# EAGLE design placa (EAGLE 5.01)
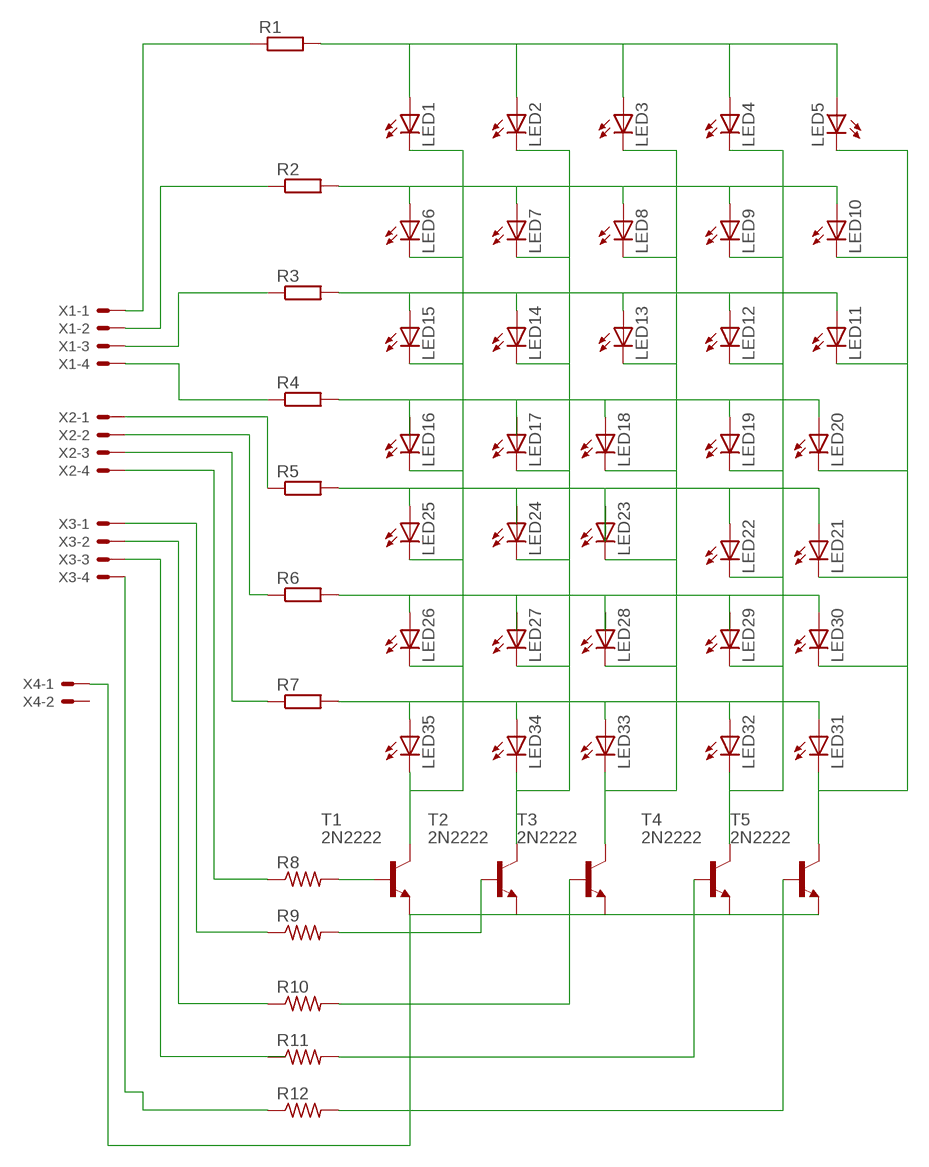
[diagram p0: schematic, sheet 1]

## Parts
LED1  LED5MM  [LED5MM]
LED2  LED5MM  [LED5MM]
LED3  LED5MM  [LED5MM]
LED4  LED5MM  [LED5MM]
LED5  LED5MM  [LED5MM]
LED6  LED5MM  [LED5MM]
LED7  LED5MM  [LED5MM]
LED8  LED5MM  [LED5MM]
LED9  LED5MM  [LED5MM]
LED10  LED5MM  [LED5MM]
LED11  LED5MM  [LED5MM]
LED12  LED5MM  [LED5MM]
LED13  LED5MM  [LED5MM]
LED14  LED5MM  [LED5MM]
LED15  LED5MM  [LED5MM]
LED16  LED5MM  [LED5MM]
LED17  LED5MM  [LED5MM]
LED18  LED5MM  [LED5MM]
LED19  LED5MM  [LED5MM]
LED20  LED5MM  [LED5MM]
LED21  LED5MM  [LED5MM]
LED22  LED5MM  [LED5MM]
LED23  LED5MM  [LED5MM]
LED24  LED5MM  [LED5MM]
LED25  LED5MM  [LED5MM]
LED26  LED5MM  [LED5MM]
LED27  LED5MM  [LED5MM]
LED28  LED5MM  [LED5MM]
LED29  LED5MM  [LED5MM]
LED30  LED5MM  [LED5MM]
LED31  LED5MM  [LED5MM]
LED32  LED5MM  [LED5MM]
LED33  LED5MM  [LED5MM]
LED34  LED5MM  [LED5MM]
LED35  LED5MM  [LED5MM]
R1  R-EU_0204/7  [0204/7]
R2  R-EU_0204/7  [0204/7]
R3  R-EU_0204/7  [0204/7]
R4  R-EU_0204/7  [0204/7]
R5  R-EU_0204/7  [0204/7]
R6  R-EU_0204/7  [0204/7]
R7  R-EU_0204/7  [0204/7]
R8  R-US_0204/7  [0204/7]
R9  R-US_0204/7  [0204/7]
R10  R-US_0204/7  [0204/7]
R11  R-US_0204/7  [0204/7]
R12  R-US_0204/7  [0204/7]
T1  2N2222  [TO18]
T2  2N2222  [TO18]
T3  2N2222  [TO18]
T4  2N2222  [TO18]
T5  2N2222  [TO18]
X1  KK-156-4  [KK-156-4]
X2  KK-156-4  [KK-156-4]
X3  KK-156-4  [KK-156-4]
X4  KK-156-4  [KK-156-4]

## Nets
N$1: R8.1 X2.4
N$2: R9.1 X3.1
N$3: R10.1 X3.2
N$4: X3.3
N$5: R12.1 X3.4
N$6: R8.2 T1.2(B)
N$7: R9.2 T2.2(B)
N$8: R10.2 T3.2(B)
N$9: R11.2 T4.2(B)
N$10: R12.2 T5.2(B)
N$11: R1.1 X1.1
N$12: LED1.A LED2.A LED3.A LED4.A LED5.A R1.2
N$13: R2.1 X1.2
N$14: LED6.A LED7.A LED8.A LED9.A LED10.A R2.2
N$15: R3.1 X1.3
N$16: LED11.A LED12.A LED13.A LED14.A LED15.A R3.2
N$17: R4.1 X1.4
N$18: LED18.A LED19.A LED20.A R4.2
N$19: R5.1 X2.1
N$20: LED21.A LED22.A LED25.A R5.2
N$21: R6.1 X2.2
N$22: LED26.A LED30.A R6.2
N$23: R7.1 X2.3
N$24: LED31.A LED32.A LED33.A LED34.A LED35.A R7.2
N$25: LED1.K(C) LED6.K(C) LED15.K(C) LED16.K(C) LED25.K(C) LED26.K(C) LED35.K(C) T1.3(C)
N$26: LED2.K(C) LED7.K(C) LED14.K(C) LED17.K(C) LED24.K(C) LED27.K(C) LED34.K(C) T2.3(C)
N$27: LED3.K(C) LED8.K(C) LED13.K(C) LED18.K(C) LED23.K(C) LED28.K(C) LED33.K(C) T3.3(C)
N$28: LED4.K(C) LED9.K(C) LED12.K(C) LED19.K(C) LED22.K(C) LED29.K(C) LED32.K(C) T4.3(C)
N$29: LED5.K(C) LED10.K(C) LED11.K(C) LED20.K(C) LED21.K(C) LED30.K(C) LED31.K(C) T5.3(C)
N$30: T1.1(E) T2.1(E) T3.1(E) T4.1(E) T5.1(E) X4.1
Unconnected: LED16.A LED17.A LED23.A LED24.A LED27.A LED28.A LED29.A R11.1 X4.2 X4.3 X4.4

## Library data of the parts
LED1-LED35 = led:LED: LED OSRAM: - CHIPLED LG R971, LG N971, LY N971, LG Q971, LY Q971, LO R971, LY R971 LH N974, LH R974 LS Q976, LO Q976, LY Q976 LO Q996 - Hyper CHIPLED LW Q18S LB Q993, LB Q99A, LB R99A - SideLED LS A670, LO A670, LY A670, LG A670, LP A670 LB A673, LV A673, LT A673, LW A673 LH A674 LY A675 LS A676, LA A676, LO A676, LY A676, LW A676 LS A679, LY A679, LG A679 - Hyper Micro SIDELED® LS Y876, LA Y876, LO Y876, LY Y876 LT Y87S - SmartLED LW L88C, LW L88S LB L89C, LB L89S, LG L890 LS L89K, LO L89K, LY L89K LS L896, LA L896, LO L896, LY L896 - TOPLED LS T670, LO T670, LY T670, LG T670, LP T670 LSG T670, LSP T670, LSY T670, LOP T670, LYG T670 LG T671, LOG T671, LSG T671 LB T673, LV T673, LT T673, LW T673 LH T674 LS T676, LA T676, LO T676, LY T676, LB T676, LH T676, LSB T676, LW T676 LB T67C, LV T67C, LT T67C, LS T67K, LO T67K, LY T67K, LW E67C LS E67B, LA E67B, LO E67B, LY E67B, LB E67C, LV E67C, LT E67C LW T67C LS T679, LY T679, LG T679 LS T770, LO T770, LY T770, LG T770, LP T770 LB T773, LV T773, LT T773, LW T773 LH T774 LS E675, LA E675, LY E675, LS T675 LS T776, LA T776, LO T776, LY T776, LB T776 LHGB T686 LT T68C, LB T68C - Hyper Mini TOPLED® LB M676 - Mini TOPLED Santana® LG M470 LS M47K, LO M47K, LY M47K Source: http://www.osram.convergy.de - LUMILED® LXK2-PW12-R00, LXK2-PW12-S00, LXK2-PW14-U00, LXK2-PW14-V00 LXK2-PM12-R00, LXK2-PM12-S00, LXK2-PM14-U00 LXK2-PE12-Q00, LXK2-PE12-R00, LXK2-PE12-S00, LXK2-PE14-T00, LXK2-PE14-U00 LXK2-PB12-K00, LXK2-PB12-L00, LXK2-PB12-M00, LXK2-PB14-N00, LXK2-PB14-P00, LXK2-PB14-Q00 LXK2-PR12-L00, LXK2-PR12-M00, LXK2-PR14-Q00, LXK2-PR14-R00 LXK2-PD12-Q00, LXK2-PD12-R00, LXK2-PD12-S00 LXK2-PH12-R00, LXK2-PH12-S00 LXK2-PL12-P00, LXK2-PL12-Q00, LXK2-PL12-R00 Source: www.luxeon.com
R1-R7 = resistor:R-EU_: RESISTOR, European symbol
R8-R12 = resistor:R-US_: RESISTOR, American symbol
T1-T5 = transistor:2N2222: NPN TRANSISTOR
X1-X4 = con-molex:KK-156-4: KK 156 HEADER Source: http://www.molex.com/pdm_docs/sd/026604100_sd.pdf

## Board
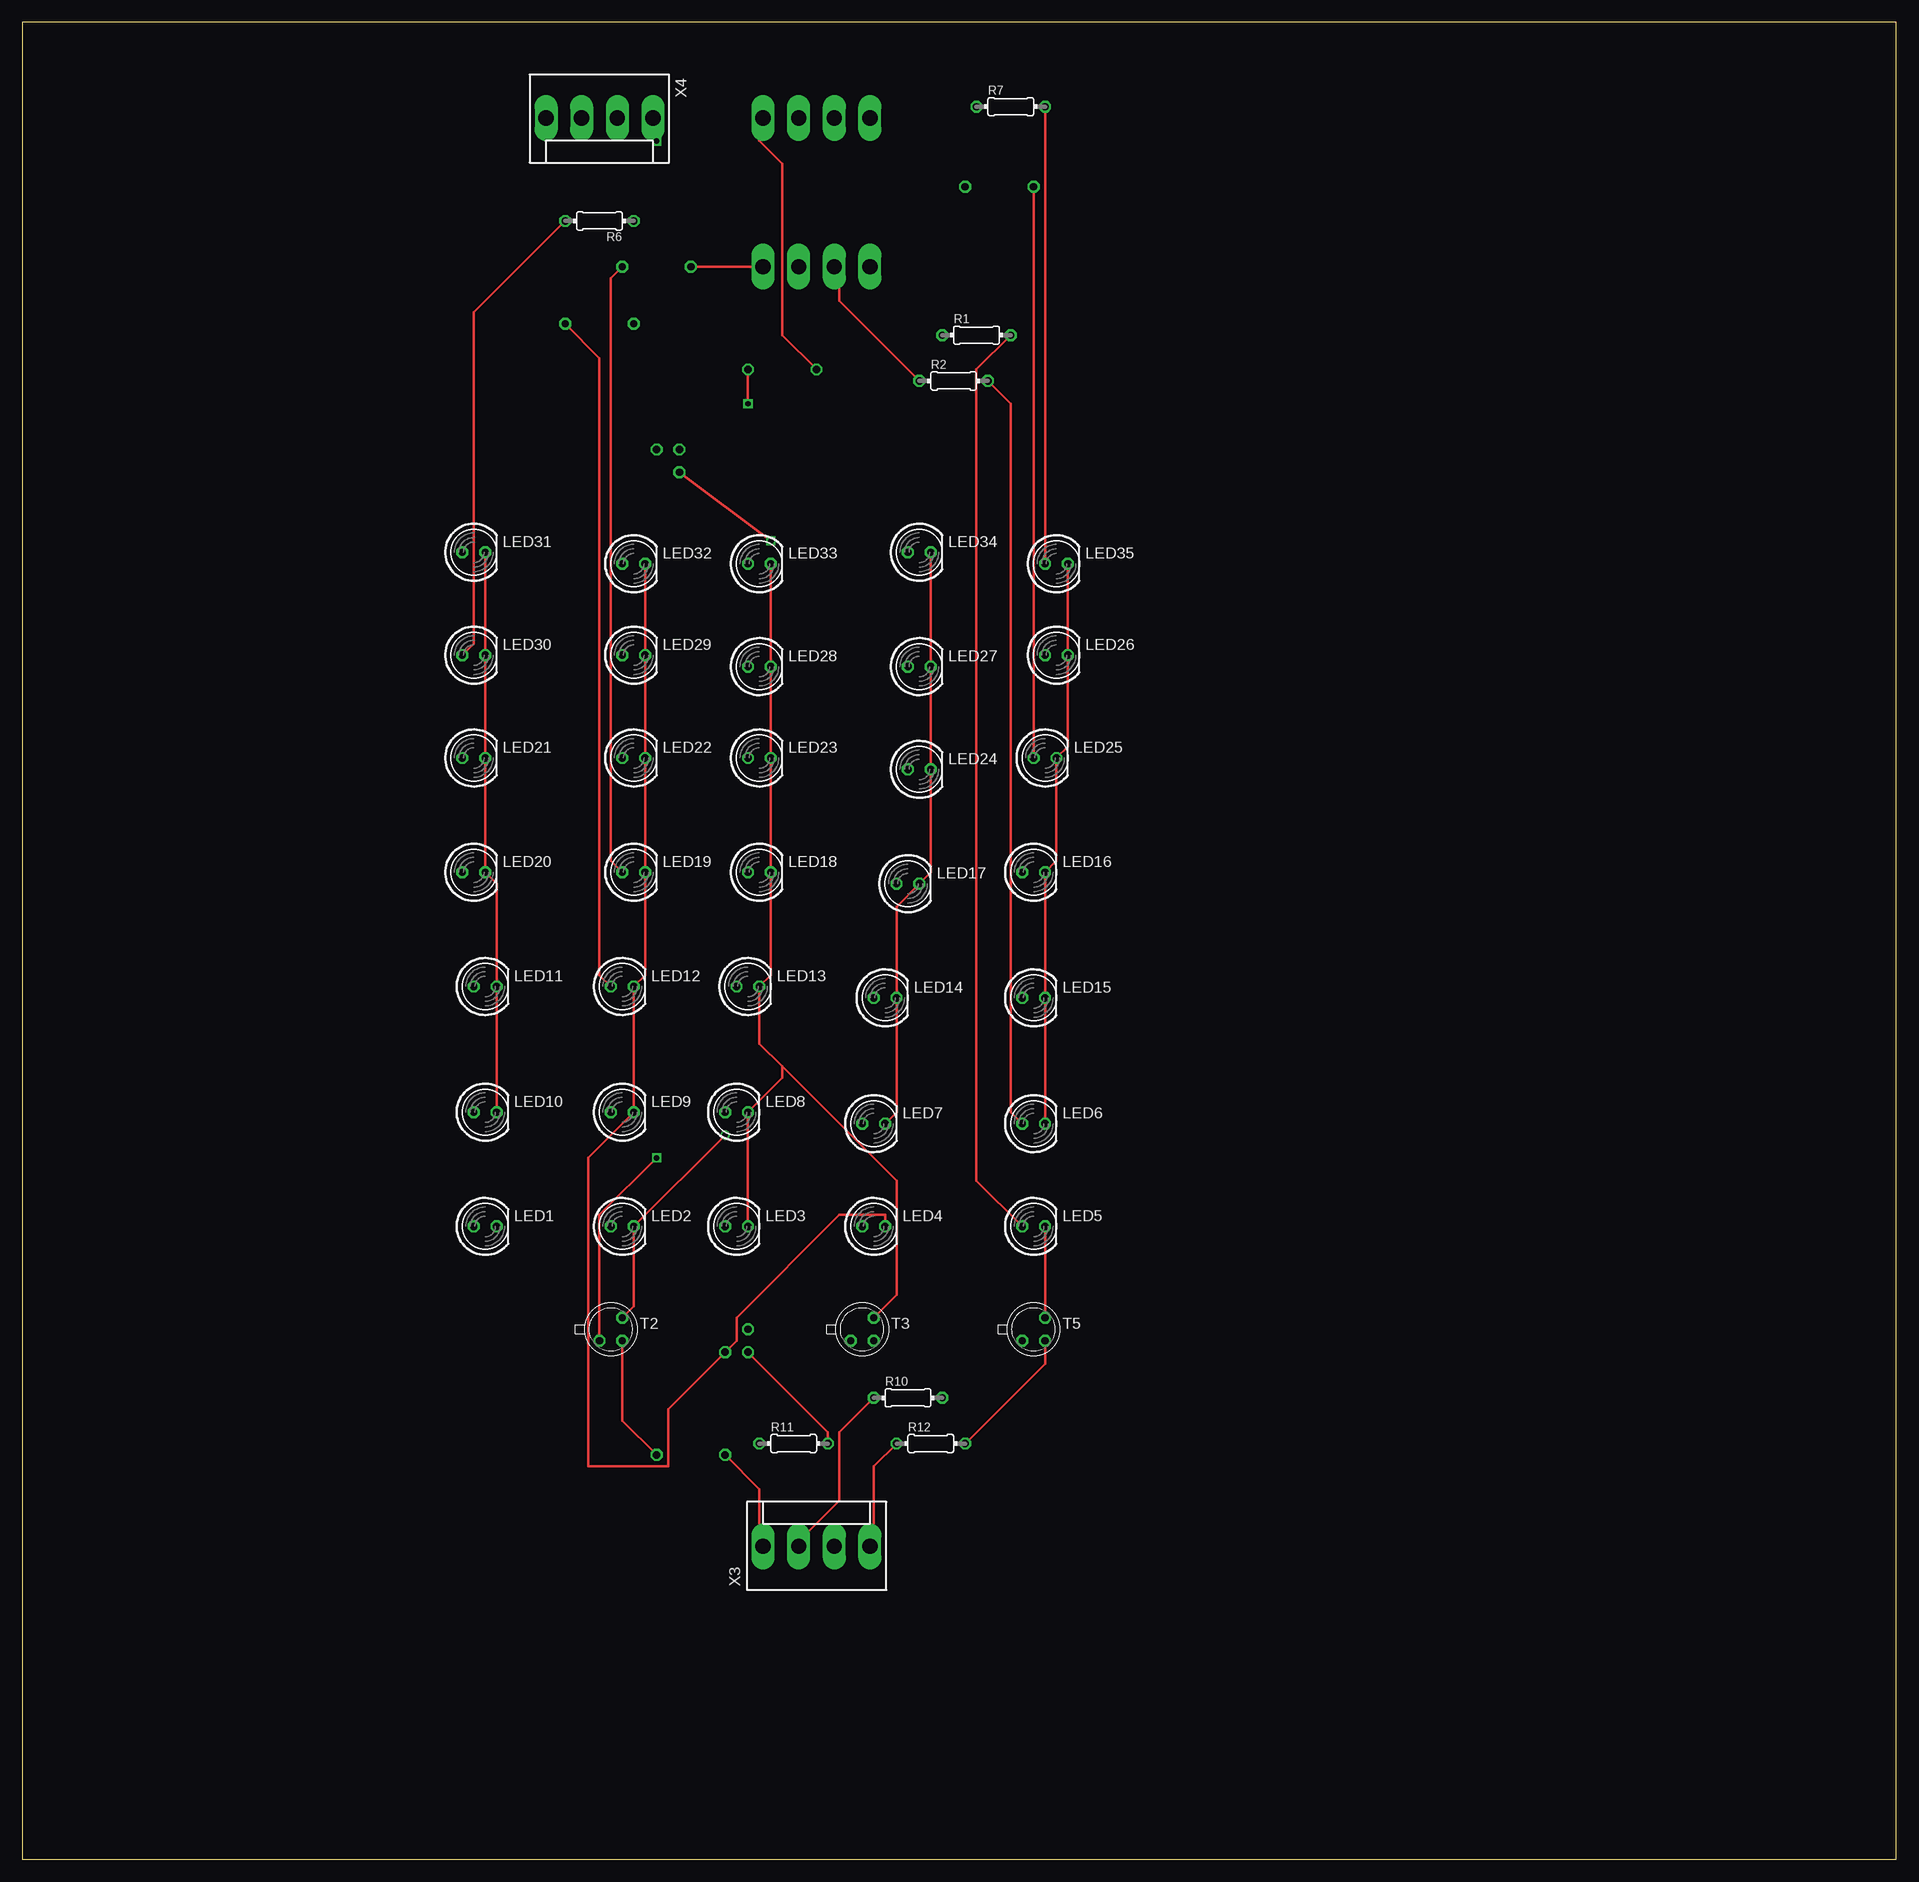
[diagram p1: board, top side]
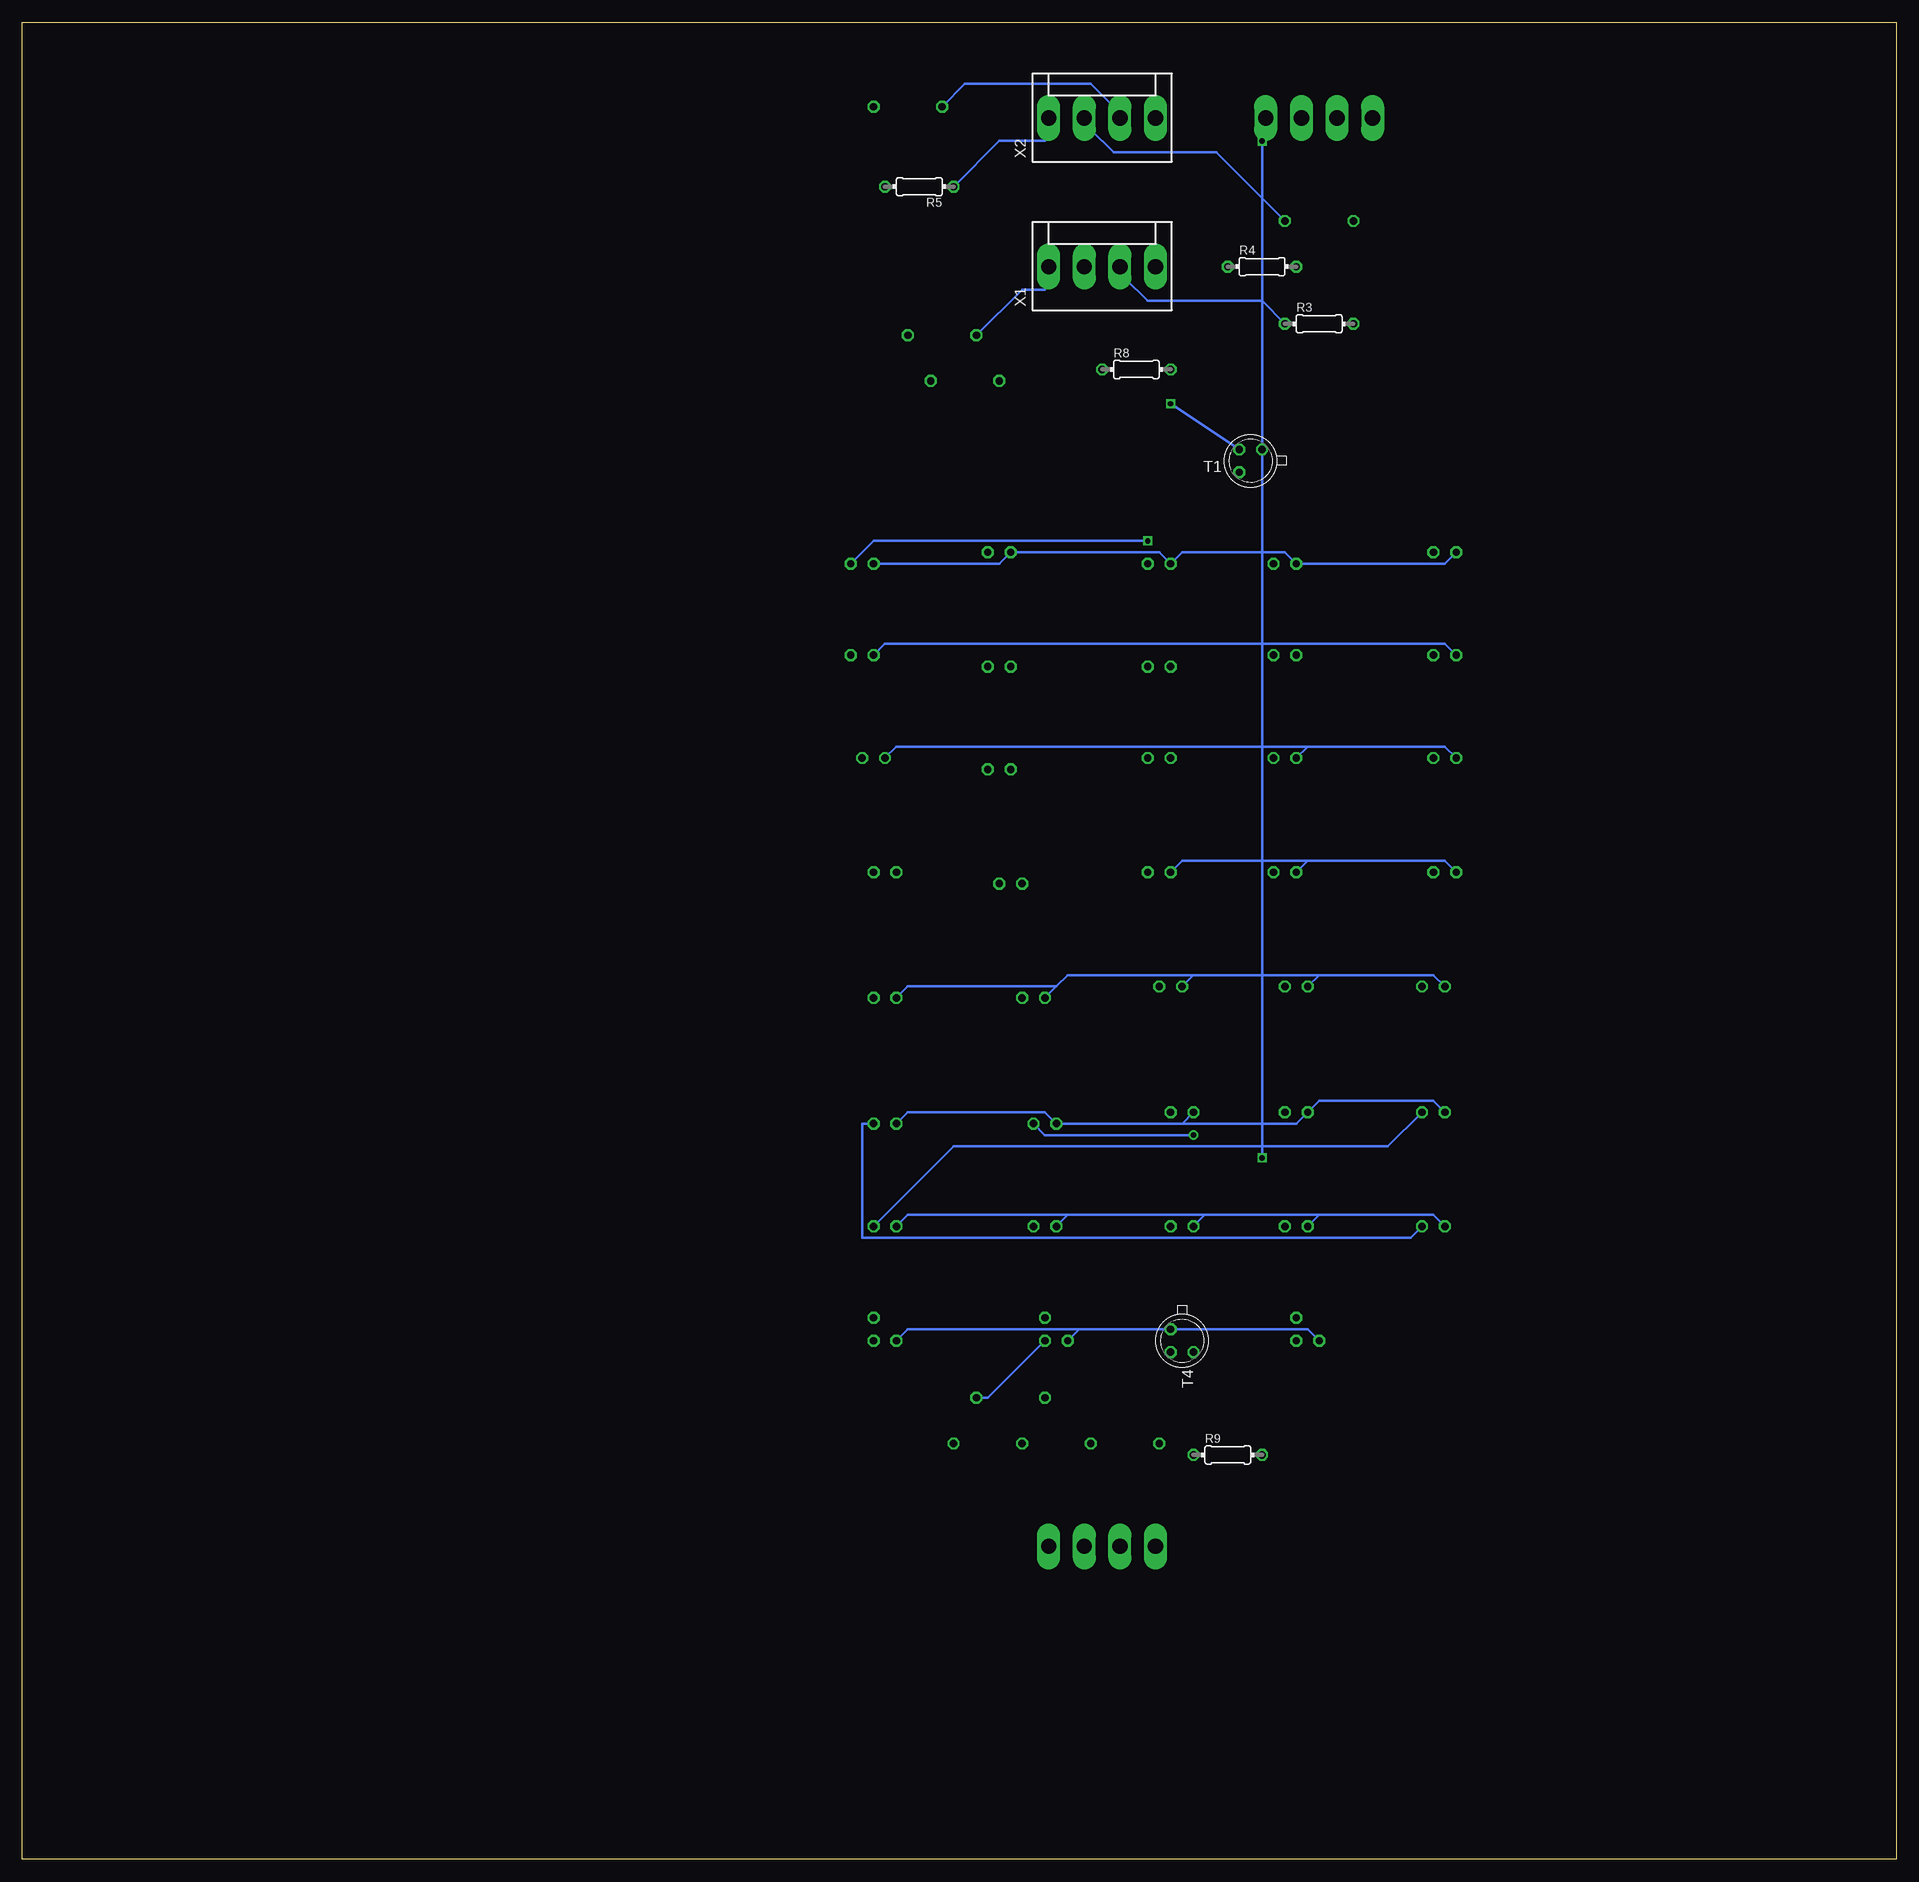
[diagram p2: board, bottom side, seen from below]

Size 208.26 x 204.14 mm. Coordinates in mm from the lower left corner, seen from the top.
Outline: 0,0 208.26,0 208.26,204.14 0,204.14 0,0
Copper layers (1*16): Top 0.035mm / dielectric 1.5mm / Bottom 0.035mm
Design rules "default": minimum track width 10mil, minimum drill 24mil, track to track 8mil, track to pad 8mil, pad to pad 8mil, via to via 8mil, smd to smd 8mil, copper to edge 40mil, drill to drill 8mil, minimum pad ring 10mil, minimum via ring 8mil, stop-mask expansion 4mil, vias tented up to drill 0mil, thermal gap 10mil

### Footprints (pad centres in the part's own frame; a part is rotated, then mirrored left to right if it is on the bottom)
LED5MM = drill 0.813 octagon: A -1.27,0; K 1.27,0
0204/7 = drill 0.813 octagon: 1 -3.81,0; 2 3.81,0
TO18 = drill 0.813 octagon: 1 -1.27,-1.27; 2 1.27,-1.27; 3 1.27,1.27
KK-156-4 = drill 1.7 pad 2.184 long: 1 -5.94,0; 2 -1.98,0; 3 1.98,0; 4 5.94,0

### Placement (x,y rotation side)
LED1  51.43,70.32 0 top
LED2  66.67,70.32 0 top
LED3  79.37,70.32 0 top
LED4  94.61,70.32 0 top
LED5  112.39,70.32 0 top
LED6  112.39,81.75 0 top
LED7  94.61,81.75 0 top
LED8  79.37,83.02 0 top
LED9  66.67,83.02 0 top
LED10  51.43,83.02 0 top
LED11  51.43,96.99 0 top
LED12  66.67,96.99 0 top
LED13  80.64,96.99 0 top
LED14  95.88,95.72 0 top
LED15  112.39,95.72 0 top
LED16  112.39,109.69 0 top
LED17  98.42,108.42 0 top
LED18  81.91,109.69 0 top
LED19  67.94,109.69 0 top
LED20  50.16,109.69 0 top
LED21  50.16,122.39 0 top
LED22  67.94,122.39 0 top
LED23  81.91,122.39 0 top
LED24  99.69,121.12 0 top
LED25  113.66,122.39 0 top
LED26  114.93,133.82 0 top
LED27  99.69,132.55 0 top
LED28  81.91,132.55 0 top
LED29  67.94,133.82 0 top
LED30  50.16,133.82 0 top
LED31  50.16,145.25 0 top
LED32  67.94,143.98 0 top
LED33  81.91,143.98 0 top
LED34  99.69,145.25 0 top
LED35  114.93,143.98 0 top
R1  106.04,169.38 0 top
R2  103.5,164.3 0 top
R3  64.13,170.65 0 bottom
R4  70.48,177 0 bottom
R5  108.58,185.89 180 bottom
R6  64.13,182.08 180 top
R7  109.85,194.78 0 top
R8  84.45,165.57 0 bottom
R9  74.29,44.92 0 bottom
R10  98.42,51.27 0 top
R11  85.72,46.19 0 top
R12  100.96,46.19 0 top
T1  71.75,155.41 180 bottom
T2  65.4,58.89 0 top
T3  93.34,58.89 0 top
T4  79.37,57.62 270 bottom
T5  112.39,58.89 0 top
X1  88.26,177 0 bottom
X2  88.26,193.51 0 bottom
X3  88.26,34.76 0 top
X4  64.13,193.51 180 top

### Tracks (layer width: path | path; a pad name or v marks a point on that pad's centre or on a via)
N$1
  Top 0.254: R8.1 84.45,169.38 84.45,188.43 81.91,190.97 X2.4
N$2
  Top 0.254: R9.1 81.91,41.11 81.91,37.3 X3.1
N$3
  Top 0.254: R10.1 90.8,47.46 90.8,39.84 86.99,36.03 X3.2
N$5
  Top 0.254: R12.1 94.61,43.65 94.61,37.3 X3.4
N$6  (via drill 0.6)
  Top 0.254: v80.64,161.76 R8.2
  Bottom 0.254: T1.2 v80.64,161.76
N$7
  Top 0.254: R9.2 66.67,48.73 T2.2
N$8
  Bottom 0.254: T3.2 100.96,51.27 R10.2
N$9
  Top 0.254: T4.2 89.53,47.46 R11.2
N$10
  Top 0.254: R12.2 113.66,55.08 T5.2
N$11
  Bottom 0.254: R1.1 97.15,174.46 94.61,174.46 X1.1
N$12
  Top 0.254: R1.2 106.04,165.57 106.04,75.4 LED5.A
  Bottom 0.254: LED1.A 51.43,71.59 64.13,71.59 | 64.13,71.59 LED2.A | 76.83,71.59 LED3.A | 64.13,71.59 76.83,71.59 | 92.07,71.59 LED4.A | 76.83,71.59 92.07,71.59 | LED5.A 109.85,71.59 92.07,71.59
N$13
  Top 0.254: R2.1 90.8,173.19 90.8,175.73 X1.2
N$14
  Top 0.254: R2.2 109.85,161.76 109.85,83.02 LED6.A
  Bottom 0.254: LED10.A 51.43,84.29 64.13,84.29 LED9.A 66.67,81.75 79.37,81.75 | 79.37,81.75 LED7.A 94.61,83.02 109.85,83.02 LED6.A | 79.37,81.75 LED8.A
N$15
  Bottom 0.254: R3.1 70.48,173.19 83.18,173.19 85.72,175.73 X1.3
N$16
  Top 0.254: R3.2 64.13,166.84 64.13,98.26 LED12.A
  Bottom 0.254: LED11.A 51.43,98.26 64.13,98.26 | 64.13,98.26 LED12.A | 78.1,98.26 LED13.A | 64.13,98.26 78.1,98.26 | 93.34,96.99 92.07,98.26 78.1,98.26 | 93.34,96.99 LED14.A | LED15.A 109.85,96.99 93.34,96.99
N$17
  Top 0.254: R4.1 X1.4
N$18
  Top 0.254: R4.2 65.4,175.73 65.4,110.96 LED19.A
  Bottom 0.254: LED20.A 50.16,110.96 65.4,110.96 | 65.4,110.96 LED19.A | LED18.A 79.37,110.96 65.4,110.96
N$19
  Bottom 0.254: R5.1 99.69,190.97 94.61,190.97 X2.1
N$20
  Top 0.254: LED25.A R5.2
  Bottom 0.254: LED21.A 50.16,123.66 65.4,123.66 | 65.4,123.66 LED22.A | LED25.A 111.12,123.66 65.4,123.66
N$21
  Bottom 0.254: R6.1 75.56,189.7 86.99,189.7 89.53,192.24 X2.2
N$22
  Top 0.254: LED30.A 50.16,135.09 50.16,171.92 R6.2
  Bottom 0.254: LED26.A 112.39,135.09 50.16,135.09 LED30.A
N$23
  Bottom 0.254: R7.1 103.5,197.32 89.53,197.32 86.99,194.78 X2.3
N$24
  Top 0.254: LED35.A R7.2
  Bottom 0.254: LED31.A 50.16,143.98 LED32.A 67.94,145.25 79.37,145.25 LED33.A 81.91,145.25 LED34.A 99.69,143.98 LED35.A
N$25  (via drill 0.6)
  Top 0.254: LED35.K LED26.K 116.2,123.66 LED25.K 114.93,110.96 LED16.K LED15.K LED6.K | v83.18,146.52 T1.3
  Bottom 0.254: LED1.K 53.97,69.05 114.93,69.05 114.93,81.75 LED6.K | v83.18,146.52 113.66,146.52 LED35.K
N$26  (via drill 0.61)
  Top 0.254: LED34.K LED27.K LED24.K 100.96,109.69 LED17.K 97.15,105.88 LED14.K 97.15,83.02 LED7.K | T2.3 67.94,61.43 LED2.K v78.1,80.48
  Bottom 0.254: v78.1,80.48 94.61,80.48 LED7.K
N$27
  Top 0.254: LED33.K LED28.K LED23.K LED18.K 83.18,98.26 LED13.K 81.91,90.64 84.45,88.1 | LED3.K LED8.K 84.45,86.83 84.45,88.1 | T3.3 97.15,62.7 97.15,75.4 84.45,88.1
N$28
  Top 0.254: LED4.K 95.88,71.59 90.8,71.59 79.37,60.16 79.37,57.62 T4.3 71.75,50 71.75,43.65 62.86,43.65 62.86,77.94 LED9.K LED12.K 69.21,98.26 LED19.K LED22.K LED29.K LED32.K
N$29
  Top 0.254: LED31.K LED30.K LED21.K LED20.K 52.7,108.42 LED11.K LED10.K | LED5.K T5.3
  Bottom 0.254: LED5.K 104.77,79.21 56.51,79.21 LED10.K
N$30  (via drill 0.6)
  Top 0.254: v70.48,190.97 X4.1 | v70.48,77.94 64.13,71.59 T2.1
  Bottom 0.254: v70.48,190.97 T1.1 v70.48,77.94 | T2.1 65.4,58.89 T4.1 90.8,58.89 | 90.8,58.89 T3.1 | T5.1 109.85,58.89 90.8,58.89